# Altium schematic sheet WiFi.SchDoc: WiFi / Bluetooth Module
size A; DocumentNumber: 5; SheetNumber: 5; SheetTotal: 11
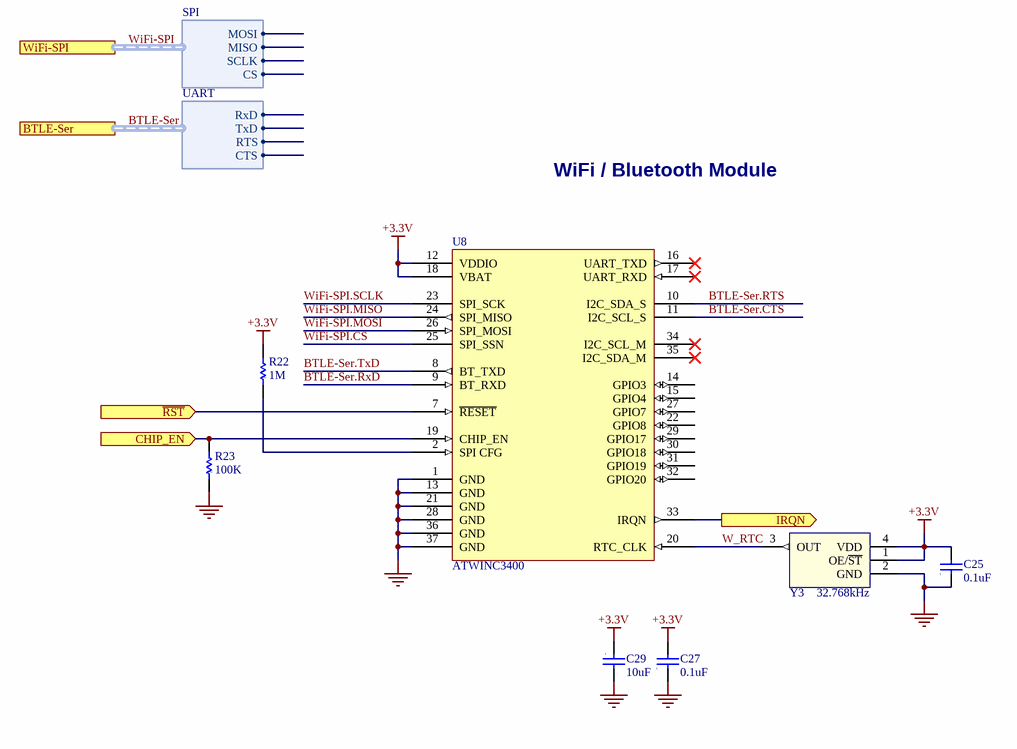
[diagram p0: WiFi.SchDoc]

## Parts
C25  value 0.1uF  [0402]  (hidden comment: Cap)
C27  value 0.1uF  [0402]  (hidden comment: Cap)
C29  value 10uF  [0805]  (hidden comment: Cap)
R22  value 1M  [R0402]  (hidden comment: Res)
R23  value 100K  [R0402]  (hidden comment: Res)
U8  ATWINC3400  [ATWILC3000]
Y3  Frequency: 32.768kHz  [SiT1533]  (hidden comment: Oscillator2)

## Ports
BTLE-Ser (harness UART), CHIP_EN (in), IRQN (out), WiFi-SPI (harness SPI), ~{RST} (in)

## Harnesses
SPI: MOSI, MISO, CS, SCLK
UART: RxD, TxD, CTS, RTS

## Nets
+3.3V: C25.2 C27.2 C29.1 R22.2 U8.12(VDDIO) U8.18(VBAT) Y3.1(OE/~{ST}) Y3.4(VDD)
GND: C25.1 C27.1 C29.2 R23.1 U8.1(GND) U8.13(GND) U8.21(GND) U8.28(GND) U8.36(GND) U8.37(GND) Y3.2(GND)
~{RST}: U8.7(~{RESET}) ; port ~{RST}
BTLE-Ser.CTS: U8.11(I2C_SCL_S)
BTLE-Ser.RTS: U8.10(I2C_SDA_S)
BTLE-Ser.RxD: U8.9(BT_RXD)
BTLE-Ser.TxD: U8.8(BT_TXD)
CHIP_EN: R23.2 U8.19(CHIP_EN) ; port CHIP_EN
IRQN: U8.33(IRQN) ; port IRQN
W_RTC: U8.20(RTC_CLK) Y3.3(OUT)
WiFi-SPI.CS: U8.25(SPI_SSN)
WiFi-SPI.MISO: U8.24(SPI_MISO)
WiFi-SPI.MOSI: U8.26(SPI_MOSI)
WiFi-SPI.SCLK: U8.23(SPI_SCK)
NetR22_1: R22.1 U8.2(SPI_CFG)

Not connected (* = marked no-connect by the designer): U8 14(GPIO3) 15(GPIO4) 16(UART_TXD)* 17(UART_RXD)* 22(GPIO8) 27(GPIO7) 29(GPIO17) 30(GPIO18) 31(GPIO19) 32(GPIO20) 34(I2C_SCL_M)* 35(I2C_SDA_M)*

## Buses and harness runs
harness BTLE-Ser = port BTLE-Ser
harness WiFi-SPI = port WiFi-SPI

## Notes on the sheet
- WiFi / Bluetooth Module
- Date
- Sheet
- Project
- Time
- PCB
- Assy
- of
- Size
- A
- File

## Library data of the parts
C25 C27 = Cap: CAP CER .10UF 50V X7R 10% 0402; Manufacturer: TDK Corporation; Manufacturer Part Number: C1005X7R1H104K; Capacitance: 0.1µF; Published: 8-Jun-2000; LatestRevisionDate: 17-Jul-2002; LatestRevisionNote: Re-released for DXP Platform.; Publisher: Altium Limited; Category: Capacitors; Supplier 1: Digi-Key; Supplier Part Number 1: 445-5932-1-ND; RoHS: RoHS Compliant; Stock 1: 174080; Pricing 1: 1=0.3, 10=0.2, 100=0.08, 250=0.05752, 500=0.041, 1000=0.03 (USD); Voltage - Rated: 50V; Tolerance: ±10%; Temperature Coefficient: X7R; Mounting Type: Surface Mount, MLCC; Operating Temperature: -55°C ~ 125°C; Applications: General Purpose; Ratings: -; Package / Case: 0402 (1005 Metric); Size / Dimension: 0.039" L x 0.020" W (1.00mm x 0.50mm); Height: -; Thickness: 0.022" (0.55mm); Lead Spacing: -; Features: -; Packaging: Cut Tape (CT); Lead Style: -; ComponentLink1URL: http://www.tdk.co.jp/tefe02/e412_c.pdf; ComponentLink1Description: http://www.tdk.co.jp/tefe02/e412_c.pdf
C29 = Cap: CAP CER 10UF 35V X5R 0805; Manufacturer: TDK; Manufacturer Part Number: C2012X5R1V106K085AC; Dielectric Material: Ceramic; Tolerance: 10%; Published: 8-Jun-2000; LatestRevisionDate: 17-Jul-2002; LatestRevisionNote: Re-released for DXP Platform.; Publisher: Altium Limited; Category: Capacitors; Supplier 1: Digi-Key; Supplier Part Number 1: 445-14417-6-ND; Stock 1: 0; Pricing 1: 1=0.83, 10=0.589, 100=0.3881, 500=0.2875, 1000=0.24438 (USD); Mount: Surface Mount; Case/Package: 0805; Weight: 0.000194oz; Case Code (Metric): 2012; Case Code (Imperial): 0805; Min Operating Temperature: -55°C; Max Operating Temperature: 85°C; Package Quantity: 1; Packaging: Tape and Reel; Capacitance: 10uF; Voltage Rating: 35V; Termination: SMD/SMT; Voltage Rating (DC): 35V; Dielectric: X5R; Length: 0.079inch; Height: 0.85mm; Width: 0.049inch; Thickness: 0.039inch; Lead Free: Lead Free; REACH SVHC: No SVHC; ComponentLink1URL: https://datasheet.ciiva.com/14894/tdkmlcccaprange-14894527.pdf; ComponentLink1Description: https://datasheet.ciiva.com/14894/tdkmlcccaprange-14894527.pdf
R22 = Res: RES SMD 1M OHM 5% 1/10W 0402; Manufacturer: Panasonic; Manufacturer Part Number: ERJ-2GEJ105X; Resistance: 1MR; Temperature Coefficient: 200ppm/°C; Power Rating: 100mW; Voltage Rating: 50V; Supplier 1: Digi-Key; Supplier Part Number 1: P1.0MJDKR-ND; Stock 1: 678090; Pricing 1: 1=0.1, 10=0.031, 100=0.0125, 1000=0.0056, 2500=0.00486, 5000=0.00401 (USD); Mount: Surface Mount; Case/Package: 0402; Case Code (Imperial): 0402; Case Code (Metric): 1005; Contact Plating: Tin; Min Operating Temperature: -55°C; Max Operating Temperature: 155°C; Packaging: Tape and Reel; Tolerance: 5%; Composition: Thick Film; Military Standard: Not; Number of Terminations: 2; Termination: SMD/SMT; Max Power Dissipation: 100mW; Package Quantity: 1; Voltage Rating (DC): 50V; Features: Automotive AEC-Q200; Length: 1mm; Height: 0.35mm; Depth: 0.5mm; Width: 0.5mm; Radiation Hardening: No; REACH SVHC: No SVHC; Lead Free: Lead Free
R23 = Res: RES SMD 100K OHM 1% 1/16W 0402; Manufacturer: Panasonic; Manufacturer Part Number: ERJ-2RKF1003X; Resistance: 100kR; Temperature Coefficient: 100ppm/°C; Power Rating: 100mW; Voltage Rating: 50V; Supplier 1: Digi-Key; Supplier Part Number 1: P100KLDKR-ND; Stock 1: 6572; Pricing 1: 1=0.1, 10=0.045, 100=0.0184, 1000=0.00826, 2500=0.00717, 5000=0.00593 (USD); Mount: Surface Mount; Case/Package: 0402; Number of Pins: 2; Contact Plating: Tin; Case Code (Imperial): 0402; Case Code (Metric): 1005; Min Operating Temperature: -55°C; Max Operating Temperature: 155°C; Tolerance: 1%; Composition: Thick Film; Packaging: Tape and Reel; Package Quantity: 1; Termination: SMD/SMT; Number of Terminations: 2; Military Standard: Not; Max Power Dissipation: 100mW; Voltage Rating (DC): 50V; Features: Automotive AEC-Q200; Length: 1mm; Height: 0.35mm; Width: 0.5mm; Depth: 0.5mm; Radiation Hardening: No; REACH SVHC: No SVHC; Lead Free: Lead Free
U8 = ATWINC3400: WIFI/BLE MODULE; Manufacturer: Microchip; Manufacturer Part Number: ATWINC3400-MR210UA122; Supplier 1: Digi-Key; Supplier Part Number 1: ATWINC3400-MR210UA122-ND; Stock 1: 0
Y3 = Oscillator2: OSC MEMS 32.768KHZ LVCMOS SMD; Manufacturer: SiTime; Manufacturer Part Number: SIT1533AI-H4-DCC-32.768E; Frequency Stability: 100ppm; Max Supply Current: 1.4uA; Load Capacitance: 10pF; Min Supply Voltage: 1.5V; Max Supply Voltage: 3.63V; Current Rating: 1.35uA; Max Duty Cycle: 52%; VALUE: ?; Supplier 1: Digi-Key; Supplier Part Number 1: 1473-1239-1-ND; Stock 1: 127563; Pricing 1: 1=1.21, 10=1.072, 50=1.0018, 100=0.8852, 500=0.83866 (USD); Mount: Surface Mount; Case/Package: SMD/SMT; Number of Pins: 4; Min Operating Temperature: -40°C; Max Operating Temperature: 85°C; Packaging: Tape and Reel; Termination: SMD/SMT; Package Quantity: 1000; Length: 0.079inch; Height: 0.024inch; Width: 0.047inch; Supplier 2: Digi-Key; Supplier Part Number 2: 1473-1239-6-ND; Stock 2: 135399; Pricing 2: 1=1.21, 10=1.072, 50=1.0018, 100=0.8852, 500=0.83866 (USD)